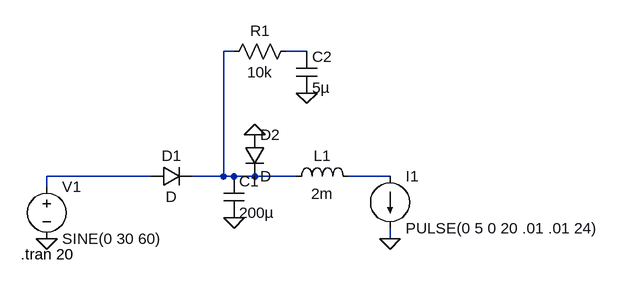
[diagram p0: schematic Draft3.asc]
Draft3.asc, the LTspice schematic file:
Version 4
SHEET 1 916 680
WIRE 336 -80 320 -80
WIRE 448 -80 416 -80
WIRE 208 112 48 112
WIRE 320 112 320 -80
WIRE 320 112 272 112
WIRE 336 112 320 112
WIRE 368 112 336 112
WIRE 432 112 368 112
WIRE 576 112 512 112
WIRE 48 128 48 112
WIRE 576 208 576 192
FLAG 48 208 0
FLAG 336 176 0
FLAG 576 208 0
FLAG 368 48 0
FLAG 448 -16 0
SYMBOL voltage 48 112 R0
WINDOW 123 0 0 Left 0
WINDOW 39 0 0 Left 0
SYMATTR InstName V1
SYMATTR Value SINE(0 30 60)
SYMBOL diode 208 128 R270
WINDOW 0 32 32 VTop 2
WINDOW 3 0 32 VBottom 2
SYMATTR InstName D1
SYMBOL cap 320 112 R0
SYMATTR InstName C1
SYMATTR Value 200µ
SYMBOL ind 416 128 R270
WINDOW 0 32 56 VTop 2
WINDOW 3 5 56 VBottom 2
SYMATTR InstName L1
SYMATTR Value 2m
SYMBOL load2 576 112 R0
WINDOW 123 0 0 Left 0
WINDOW 39 0 0 Left 0
SYMATTR InstName I1
SYMATTR Value PULSE(0 5 0 20 .01 .01 24)
SYMBOL diode 352 48 R0
SYMATTR InstName D2
SYMBOL res 432 -96 R90
WINDOW 0 0 56 VBottom 2
WINDOW 3 32 56 VTop 2
SYMATTR InstName R1
SYMATTR Value 10k
SYMBOL cap 432 -80 R0
SYMATTR InstName C2
SYMATTR Value 5µ
TEXT 8 232 Left 2 !.tran 20

The netlist it stands for:
* Draft3.asc
V1 N003 0 SINE(0 30 60)
D1 N003 N001 D
C1 N001 0 200µ
L1 N001 N004 2m
I1 N004 0 PULSE(0 5 0 20 .01 .01 24)
D2 0 N001 D
R1 N002 N001 10k
C2 N002 0 5µ
.model D D
.lib standard.dio
.tran 20
.backanno
.end